# EAGLE design IO_iJoey (EAGLE 6.1)
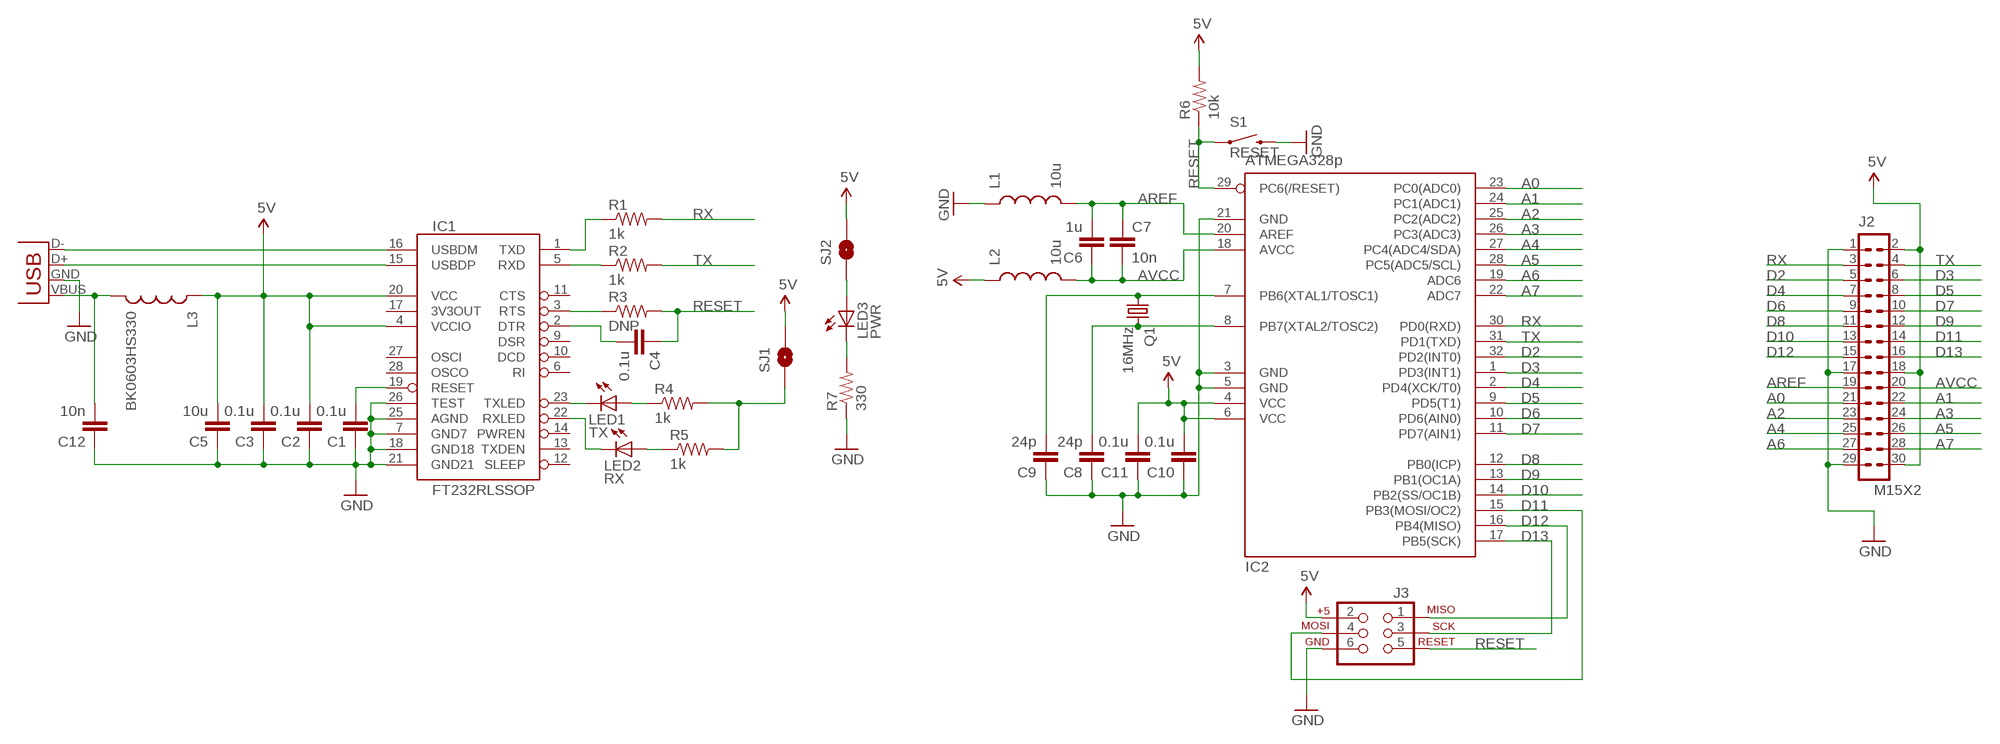
[diagram p0: schematic, sheet 1]

## Parts
C1  0.1u  CAP0603-CAP  [0603-CAP]
C2  0.1u  CAP0603-CAP  [0603-CAP]
C3  0.1u  CAP0603-CAP  [0603-CAP]
C4  0.1u  CAP0603-CAP  [0603-CAP]
C5  10u  CAP0805  [0805]
C6  1u  CAP0603-CAP  [0603-CAP]
C7  10n  CAP0603-CAP  [0603-CAP]
C8  24p  CAP0603-CAP  [0603-CAP]
C9  24p  CAP0603-CAP  [0603-CAP]
C10  0.1u  CAP0603-CAP  [0603-CAP]
C11  0.1u  CAP0603-CAP  [0603-CAP]
C12  10n  CAP0603-CAP  [0603-CAP]
IC1  FT232RLSSOP  [SSOP28DB]
IC2  ATMEGA328p  MEGA8-AI  [TQFP32-08]
J1  USB-A-H  [USB-A-H]
J2  M15X2  [2X15]
J3  AVR_SPI_PRG_6PTH  [2X3]
L1  10u  INDUCTOR0603  [0603]
L2  10u  INDUCTOR0603  [0603]
L3  BK0603HS330  INDUCTOR0603  [0603]
LED1  TX  LED0603  [LED-0603]
LED2  RX  LED0603  [LED-0603]
LED3  PWR  LED0603  [LED-0603]
Q1  16MHz  CRYSTAL-GP  [HC49_GP]
R1  1k  RESISTOR0603-RES  [0603-RES]
R2  1k  RESISTOR0603-RES  [0603-RES]
R3  DNP  RESISTOR0603-RES  [0603-RES]
R4  1k  RESISTOR0603-RES  [0603-RES]
R5  1k  RESISTOR0603-RES  [0603-RES]
R6  10k  RESISTOR0603-RES  [0603-RES]
R7  330  RESISTOR0603-RES  [0603-RES]
S1  RESET  SWITCH-MOMENTARY-2-SMD-1101NE  [TACTILE-SWITCH-1101NE]
SJ1  SOLDERJUMPERNC  [SJ_2S]
SJ2  SOLDERJUMPERNC  [SJ_2S]

## Nets
5V: C2.2 C3.2 C5.2 C10.2 C11.2 IC1.4(VCCIO) IC1.20(VCC) IC2.4(VCC) IC2.6(VCC) J2.2 J2.18 J2.30 J3.2 L2.1 L3.1 R6.2 SJ1.2 SJ2.2
A0: IC2.23(PC0(ADC0)) J2.21
A1: IC2.24(PC1(ADC1)) J2.22
A2: IC2.25(PC2(ADC2)) J2.23
A3: IC2.26(PC3(ADC3)) J2.24
A4: IC2.27(PC4(ADC4/SDA)) J2.25
A5: IC2.28(PC5(ADC5/SCL)) J2.26
A6: IC2.19(ADC6) J2.27
A7: IC2.22(ADC7) J2.28
AREF: C6.2 C7.1 IC2.20(AREF) J2.19 L1.2
AVCC: C6.1 C7.2 IC2.18(AVCC) J2.20 L2.2
D2: IC2.32(PD2(INT0)) J2.5
D3: IC2.1(PD3(INT1)) J2.6
D4: IC2.2(PD4(XCK/T0)) J2.7
D5: IC2.9(PD5(T1)) J2.8
D6: IC2.10(PD6(AIN0)) J2.9
D7: IC2.11(PD7(AIN1)) J2.10
D8: IC2.12(PB0(ICP)) J2.11
D9: IC2.13(PB1(OC1A)) J2.12
D10: IC2.14(PB2(SS/OC1B)) J2.13
D11: IC2.15(PB3(MOSI/OC2)) J2.14 J3.4
D12: IC2.16(PB4(MISO)) J2.15 J3.1
D13: IC2.17(PB5(SCK)) J2.16 J3.3
GND: C1.1 C2.1 C3.1 C5.1 C8.1 C9.1 C10.1 C11.1 C12.1 IC1.7(GND7) IC1.18(GND18) IC1.21(GND21) IC1.25(AGND) IC1.26(TEST) IC2.3(GND) IC2.5(GND) IC2.21(GND) J1.GND(VBUS) J2.1 J2.17 J2.29 J3.6 L1.1 R7.1 S1.P$2
N$1: IC1.15(USBDP) J1.D+(D-)
N$2: IC1.16(USBDM) J1.D-(D+)
N$3: C4.2 IC1.2(DTR)
N$4: C1.2 IC1.19(RESET)
N$5: C12.2 J1.VBUS(GND) L3.2
N$6: IC1.3(RTS) R3.1
N$7: IC1.5(RXD) R2.1
N$8: IC1.1(TXD) R1.1
N$9: LED3.C R7.2
N$10: IC1.23(TXLED) LED1.C
N$11: IC1.22(RXLED) LED2.C
N$12: LED2.A R5.1
N$13: LED1.A R4.1
N$14: R4.2 R5.2 SJ1.1
N$15: LED3.A SJ2.1
N$17: C9.2 IC2.7(PB6(XTAL1/TOSC1)) Q1.1
N$18: C8.2 IC2.8(PB7(XTAL2/TOSC2)) Q1.2
RESET: C4.1 IC2.29(PC6(/RESET)) J3.5 R3.2 R6.1 S1.P$1
RX: IC2.30(PD0(RXD)) J2.3 R1.2
TX: IC2.31(PD1(TXD)) J2.4 R2.2
Unconnected: IC1.6(RI) IC1.9(DSR) IC1.10(DCD) IC1.11(CTS) IC1.12(SLEEP) IC1.13(TXDEN) IC1.14(PWREN) IC1.17(3V3OUT) IC1.27(OSCI) IC1.28(OSCO)

## Library data of the parts
C1-C12 = BUG:CAP: Capacitor Standard 0603 ceramic capacitor, and 0.1" leaded capacitor.
IC1 = SparkFun-DigitalIC:FT232RL: USB UART FT232RL 4th Generation USB UART (USB <-> Serial) Controller. Spark Fun Electronics SKU : COM-00650
IC2 = atmel:MEGA8: MICROCONTROLLER 8 Kbytes FLASH, 1 kbytes SRAM, 512 bytes EEPROM, USART, 6-channel 10 bit ADC, 2-channel 8 bit ADC Pin compatible with Atmega48, ATMega88, ATMega168 Source: avr.lbr; MPN: ATMEGA8-16AU; OC_FARNELL: 9171371; OC_NEWARK: 73M8863
J1 = SparkFun-Connectors:USB: USB Connectors USB-B-PTH is fully proven SKU : PRT-00139 USB-miniB is fully proven SKU : PRT-00587 USB-A-PCB is untested. USB-A-H is throughly reviewed, but untested. Spark Fun Electronics SKU : PRT-00437 USB-B-SMT is throughly reviewed, but untested. Needs silkscreen touching up. USB-A-S has not been used/tested USB-MB-H has not been used/tested
J2 = BUG:M15X2: header dual row 30 position M15X2
J3 = SparkFun-Connectors:AVR_SPI_PRG_6: AVR ISP 6 Pin This is the reduced ISP connector for AVR programming. Common on Arduino. This footprint will take up less PCB space and can be used with a 10-pin to 6-pin adapter such as SKU: BOB-08508
L1-L3 = BUG:INDUCTOR: Inductors Basic Inductor/Choke - 0603 and 1206. Footprints are not proven and vary greatly between part numbers.
LED1-LED3 = BUG:LED: LEDs Standard schematic elements and footprints for 5mm, 3mm, 1206, and 0603 sized LEDs. 5mm - Spark Fun Electronics SKU : COM-00529 (and others)
Q1 = BUG:CRYSTAL: CRYSTAL
R1-R7 = BUG:RESISTOR: Resistor Basic schematic elements and footprints for 0603, 1206, and PTH resistors.
S1 = SparkFun-Electromechanical:SWITCH-MOMENTARY-2: Various NO switches- pushbuttons, reed, etc
SJ1 SJ2 = SparkFun-Passives:SOLDERJUMPER: Solder Jumper Standard SMD solder jumper. Used to automate production. Two varients : Normally Open and Normally Closed are the same, but have different paste layers. NC will have a large amount of paste and should jumper during reflow.

## Board
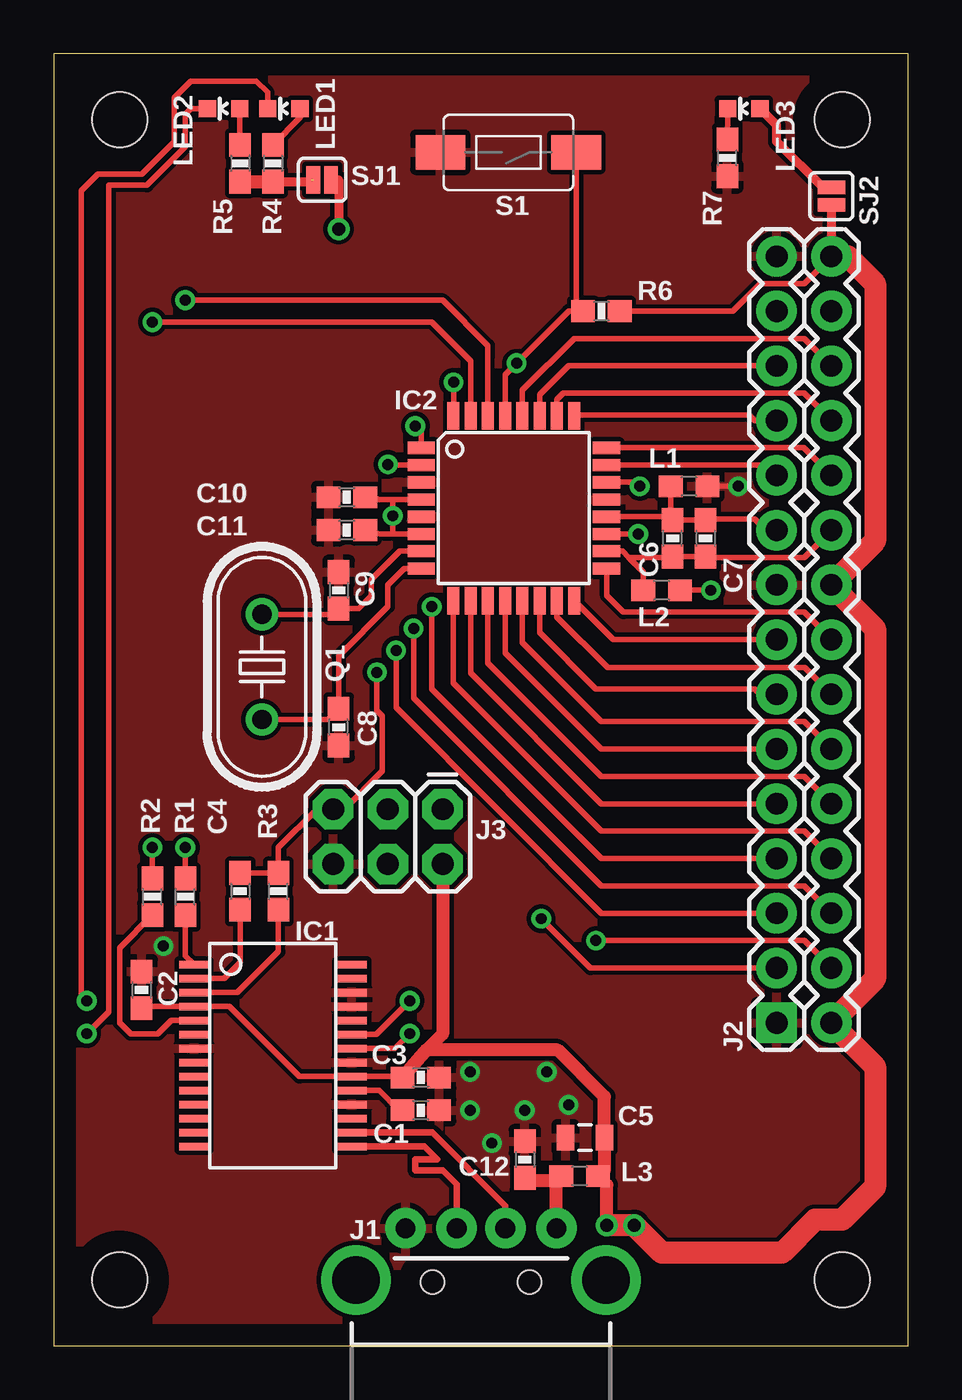
[diagram p1: board, top side]
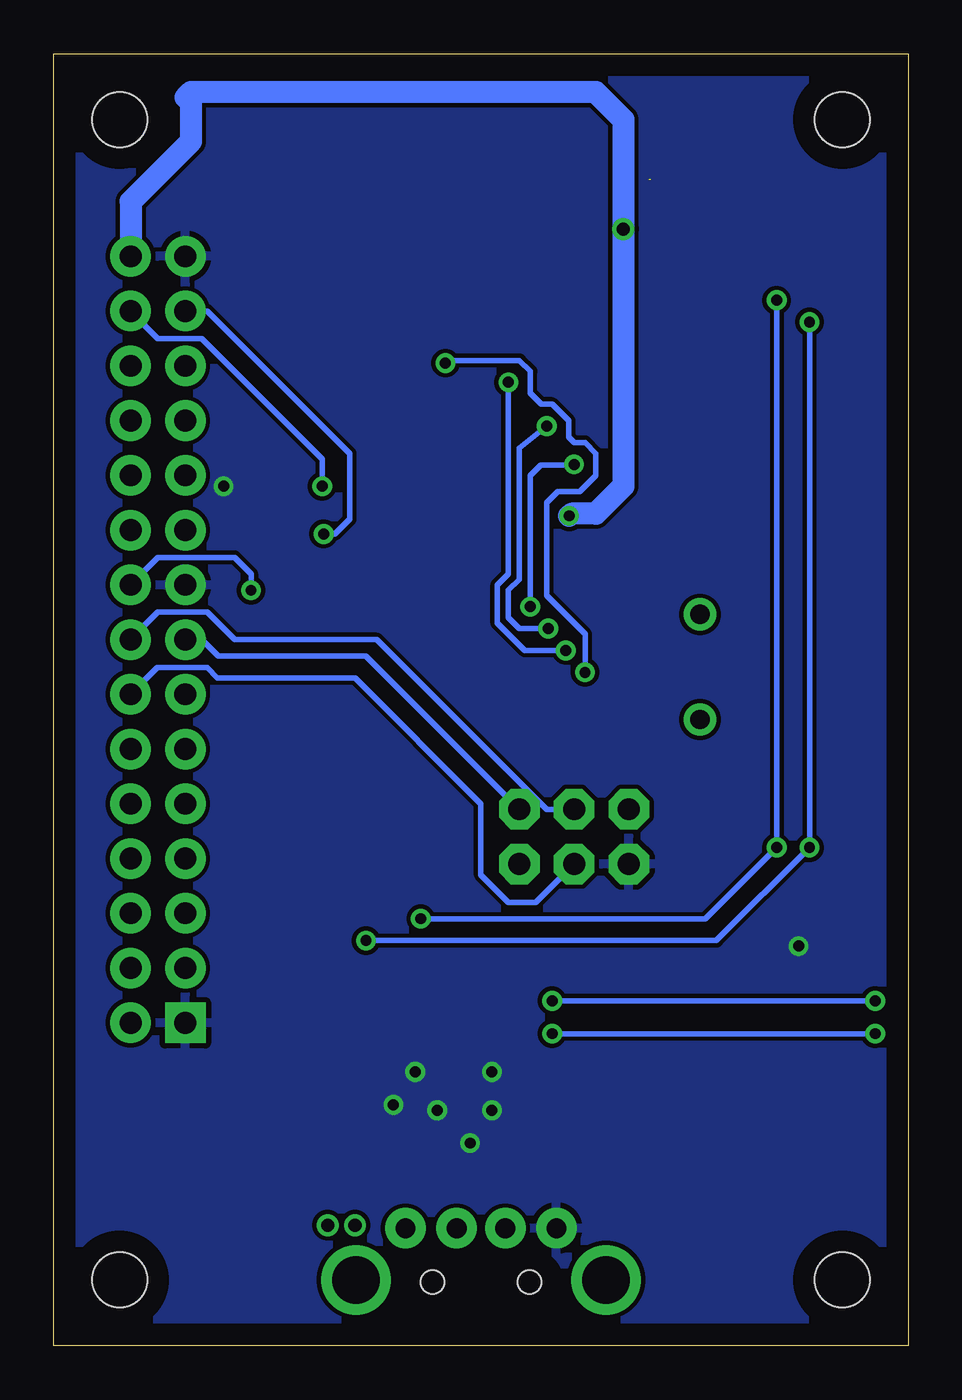
[diagram p2: board, bottom side, seen from below]

Size 39.62 x 59.94 mm. Coordinates in mm from the lower left corner, seen from the top.
Outline: 0,0 39.62,0 39.62,59.94 0,59.94 0,0
Copper layers (1*16): Top 0.035mm / dielectric 1.5mm / Bottom 0.035mm
Design rules: minimum track width 10mil, minimum drill 24mil, track to track 8mil, track to pad 8mil, pad to pad 8mil, via to via 8mil, smd to smd 8mil, copper to edge 40mil, drill to drill 8mil, minimum pad ring 10mil, minimum via ring 8mil, stop-mask expansion 4mil, vias tented up to drill 0mil, thermal gap 10mil
Holes 2.54 mm at 36.58,3.05 3.05,3.05 3.05,56.9 36.58,56.9

### Footprints (pad centres in the part's own frame; a part is rotated, then mirrored left to right if it is on the bottom)
0603-CAP = smd 1.1 x 1: 1 -0.85,0; 2 0.85,0
0805 = smd 0.8 x 1.2: 1 -0.9,0; 2 0.9,0
SSOP28DB = smd 0.348 x 1.397: 1 -4.225,-3.656; 2 -3.575,-3.656; 3 -2.925,-3.656; 4 -2.275,-3.656; 5 -1.625,-3.656; 6 -0.975,-3.656; 7 -0.325,-3.656; 8 0.325,-3.656; 9 0.975,-3.656; 10 1.625,-3.656; 11 2.275,-3.656; 12 2.925,-3.656; 13 3.575,-3.656; 14 4.225,-3.656; 15 4.225,3.656; 16 3.575,3.656; 17 2.925,3.656; 18 2.275,3.656; 19 1.625,3.656; 20 0.975,3.656; 21 0.325,3.656; 22 -0.325,3.656; 23 -0.975,3.656; 24 -1.625,3.656; 25 -2.275,3.656; 26 -2.925,3.656; 27 -3.575,3.656; 28 -4.225,3.656
TQFP32-08 = smd 1.27 x 0.559: 1 -4.293,2.8; 2 -4.293,2; 3 -4.293,1.2; 4 -4.293,0.4; 5 -4.293,-0.4; 6 -4.293,-1.2; 7 -4.293,-2; 8 -4.293,-2.8; 17 4.293,-2.8; 18 4.293,-2; 19 4.293,-1.2; 20 4.293,-0.4; 21 4.293,0.4; 22 4.293,1.2; 23 4.293,2; 24 4.293,2.8 | smd 0.559 x 1.27: 9 -2.8,-4.293; 10 -2,-4.293; 11 -1.2,-4.293; 12 -0.4,-4.293; 13 0.4,-4.293; 14 1.2,-4.293; 15 2,-4.293; 16 2.8,-4.293; 25 2.8,4.293; 26 2,4.293; 27 1.2,4.293; 28 0.4,4.293; 29 -0.4,4.293; 30 -1.2,4.293; 31 -2,4.293; 32 -2.8,4.293
USB-A-H = drill 0.914 pad 1.88: D+ 2.4,1.127; D- 2.4,-1.127; GND 2.4,3.5; VBUS 2.4,-3.5 | drill 2.2: GND2 0,-5.8; GND3 0,5.8 | hole 1.1: -0.1,2.25; -0.1,-2.25
2X15 = drill 1.016 pad 1.88 square: 1 -17.78,1.27 | drill 1.016 pad 1.88: 2 -17.78,-1.27; 3 -15.24,1.27; 4 -15.24,-1.27; 5 -12.7,1.27; 6 -12.7,-1.27; 7 -10.16,1.27; 8 -10.16,-1.27; 9 -7.62,1.27; 10 -7.62,-1.27; 11 -5.08,1.27; 12 -5.08,-1.27; 13 -2.54,1.27; 14 -2.54,-1.27; 15 0,1.27; 16 0,-1.27; 17 2.54,1.27; 18 2.54,-1.27; 19 5.08,1.27; 20 5.08,-1.27; 21 7.62,1.27; 22 7.62,-1.27; 23 10.16,1.27; 24 10.16,-1.27; 25 12.7,1.27; 26 12.7,-1.27; 27 15.24,1.27; 28 15.24,-1.27; 29 17.78,1.27; 30 17.78,-1.27
2X3 = drill 1.016 pad 1.88 octagon: 1 0,0; 2 0,2.54; 3 2.54,0; 4 2.54,2.54; 5 5.08,0; 6 5.08,2.54
0603 = smd 1.1 x 1: 1 -0.85,0; 2 0.85,0
LED-0603 = smd 0.8 x 0.8: A 0,-0.75; C 0,0.75
HC49_GP = drill 0.9 pad 1.499: 1 -2.44,0; 2 2.44,0
0603-RES = smd 1.1 x 1: 1 -0.85,0; 2 0.85,0
TACTILE-SWITCH-1101NE = smd 2.3 x 1.6: P$1 -3.15,0; P$2 3.15,0
SJ_2S = smd 0.635 x 1.27: 1 -0.412,0; 2 0.412,0

### Placement (x,y rotation side)
C1  17.02,10.92 180 top
C2  4.06,16.51 270 top
C3  17.02,12.45 180 top
C4  8.64,21.08 270 top
C5  24.64,9.65 0 top
C6  28.7,37.47 90 top
C7  30.23,37.47 270 top
C8  13.21,28.7 90 top
C9  13.21,35.05 270 top
C10  13.59,39.37 0 top
C11  13.59,37.85 0 top
C12  21.84,8.64 270 top
IC1  10.16,13.46 270 top
IC2  21.34,38.86 0 top
J1  19.81,3.05 90 top
J2  34.8,32.77 90 top
J3  18.03,24.89 180 top
L1  29.46,39.88 180 top
L2  28.19,35.05 180 top
L3  24.38,7.87 180 top
LED1  10.67,57.4 90 top
LED2  7.87,57.4 90 top
LED3  32,57.4 90 top
Q1  9.65,31.5 270 top
R1  6.1,20.83 90 top
R2  4.57,20.83 90 top
R3  10.41,21.08 90 top
R4  10.16,54.86 270 top
R5  8.64,54.86 270 top
R6  25.4,48.01 0 top
R7  31.24,55.12 90 top
S1  21.08,55.37 180 top
SJ1  12.45,54.1 0 top
SJ2  36.07,53.34 270 top

### Tracks (layer width: path | path; a pad name or v marks a point on that pad's centre or on a via)
5V  (via drill 0.51, 0.61)
  Top 0.254: L2.1 v30.48,35.05 | C11.2 15.14,37.66 15.75,37.66 | IC2.4 15.75,39.26 | 15.75,39.26 15.23,39.26 | 15.18,39.26 C10.2 | 15.75,37.66 IC2.6 16.59,37.66 | 15.18,39.26 14.97,39.26 14.61,39.62 | 16.41,39.27 15.24,39.27 | 15.24,39.27 15.19,39.27 | 15.18,39.26 15.23,39.26 | 15.23,39.26 15.24,39.27 | 15.75,37.66 15.72,37.69 v15.72,38.51 15.72,39.24 15.75,39.26 | C3.2 16.13,12.49 IC1.20 11.39,12.49 8.13,15.75 6.51,15.75 IC1.4 4.05,15.74 3.81,15.49 3.98,15.49 C2.2 | R6.2 31.5,48.01 32.77,49.28 34.8,49.28 J2.30
  Top 0.406: SJ1.2 13.21,54.1 v13.21,51.82 | SJ2.2 J2.30
  Top 0.61: v25.65,5.59 25.65,7.45 L3.1 25.54,8.18 C5.2 25.54,11.55 23.37,13.72 17.27,13.72 17.16,13.59 | 17.16,13.59 16.26,12.53 C3.2 | 13.12,51.98 v13.21,51.82 | J3.2 18.03,14.46 17.16,13.59
  Top 1.016: J2.30 36.83,50.55 38.1,49.28 38.1,37.34 J2.18 38.1,33.27 38.1,17.02 J2.2 38.1,12.95 38.1,7.37 36.58,5.84 35.31,5.84 33.78,4.32 28.19,4.32 v26.92,5.59 v25.65,5.59
  Bottom 0.254: 36.07,35.05 J2.18 34.8,36.58 31.24,36.58 30.48,35.81 v30.48,35.05
  Bottom 1.016: 33.27,58.17 14.48,58.17 13.21,56.9 v13.21,51.82 13.21,39.88 14.48,38.61 15.62,38.61 v15.72,38.51 | 33.27,58.17 33.53,57.91 | 33.27,58.17 33.27,55.88 36.07,53.09 J2.30
A0
  Top 0.254: IC2.23 33.05,40.86 J2.21
A1
  Top 0.254: J2.22 34.79,41.66 IC2.24
A2
  Top 0.254: J2.23 32.51,42.93 32.26,43.18 24.16,43.18 IC2.25
A3
  Top 0.254: J2.24 34.8,44.2 23.62,44.2 23.34,43.91 IC2.26
A4
  Top 0.254: IC2.27 22.54,44.13 23.88,45.47 J2.25
A5
  Top 0.254: IC2.28 21.74,44.34 24.13,46.74 34.8,46.74 J2.26
A6  (via drill 0.51)
  Top 0.254: IC2.19 v27.11,37.66 27.18,37.59
  Bottom 0.254: J2.27 32.51,48.01 25.91,41.4 25.91,38.35 26.6,37.66 v27.11,37.66
A7  (via drill 0.51)
  Top 0.254: IC2.22 26.99,40.06 v27.18,39.88
  Bottom 0.254: J2.28 34.8,46.74 32.77,46.74 27.18,41.15 v27.18,39.88
AREF
  Top 0.254: IC2.20 28.3,38.46 C6.2 | C6.2 C7.1 29.97,38.35 32.51,38.35 33.02,37.85 J2.19 | L1.2 28.61,38.48 C6.2
AVCC
  Top 0.254: J2.20 34.8,36.58 30.01,36.58 C7.2 C6.1 28.41,36.58 26.67,36.58 | IC2.18 26.38,36.86 26.67,36.58 | L2.2 27.34,35.9 26.67,36.58
D2  (via drill 0.51)
  Top 0.254: J2.5 25.4,20.07 15.88,29.62 v15.88,32.26 | v18.54,44.7 18.54,43.16 IC2.32
  Bottom 0.254: v15.88,32.26 17.78,32.26 19.05,33.53 19.05,35.31 18.54,35.81 v18.54,44.7
D3  (via drill 0.51)
  Top 0.254: J2.6 34.8,21.34 25.4,21.34 16.69,30.05 v16.69,33.27 | IC2.1 17.04,42.65 v16.76,42.67
  Bottom 0.254: v16.69,33.27 18.03,33.27 18.54,33.78 18.54,35.05 18.03,35.56 18.03,41.66 v16.76,42.67
D4  (via drill 0.51)
  Top 0.254: J2.7 25.4,22.61 17.53,30.48 v17.53,34.29 | IC2.2 15.53,40.86 v15.49,40.89
  Bottom 0.254: v17.53,34.29 17.53,40.38 IC2.2 15.53,40.86 v15.49,40.89
D5
  Top 0.254: J2.8 34.8,23.88 25.4,23.88 18.54,30.74 IC2.9
D6
  Top 0.254: J2.9 25.4,25.15 19.34,31.21 IC2.10
D7
  Top 0.254: J2.10 34.8,26.42 25.4,26.42 20.14,31.68 IC2.11
D8
  Top 0.254: J2.11 25.4,27.69 20.94,32.15 IC2.12
D9
  Top 0.254: J2.12 34.8,28.96 25.4,28.96 21.74,32.62 IC2.13
D10
  Top 0.254: J2.13 32.77,30.23 32.51,30.48 25.15,30.48 22.54,33.09 IC2.14
D11
  Top 0.254: J2.14 34.83,31.46 25.69,31.46 23.34,33.81 IC2.15
  Bottom 0.254: J3.4 17.27,20.57 18.54,20.57 19.81,21.84 19.81,25.15 25.65,30.99 32.04,30.99 32.51,31.46 34.83,31.46 J2.14
D12
  Top 0.254: J2.15 25.94,32.77 IC2.16
  Bottom 0.254: J3.1 25.15,32 32,32 32.77,32.77 J2.15
D13
  Top 0.254: J2.16 34.8,34.04 26.42,34.04 25.65,34.8 25.65,36.04 IC2.17
  Bottom 0.254: J3.3 16.76,24.89 24.64,32.77 31.24,32.77 32.51,34.04 34.8,34.04 J2.16
GND  (via drill 0.51)
  Top 0.254: L1.1 v31.75,39.88
  other vias: 19.3,12.7 22.86,12.7 23.88,11.18 21.84,10.92 20.32,9.4 19.3,10.92 5.08,18.54
  pour Bottom (rank 4): 0.51,59.44 39.12,59.44 39.12,0.51 0.51,0.51
  pour Top (rank 4): 0.51,59.44 39.12,59.44 39.12,0.51 0.51,0.51
N$1
  Top 0.305: J1.D+ 18.68,7.48 18.03,8.13 16.76,8.13 16.76,8.64 17.78,8.64 17.18,9.24 IC1.15
N$2
  Top 0.305: 20.94,5.73 J1.D- 20.94,6.49 17.55,9.89 IC1.16
N$3
  Top 0.254: IC1.2 7.89,17.04 8.64,17.78 C4.2
N$4
  Top 0.254: IC1.19 15.09,11.84 16,10.92 C1.2 16.26,10.92
N$5
  Top 0.61: J1.VBUS 23.31,7.65 | 23.31,7.65 L3.2 | 23.31,7.65 21.98,7.65 C12.2
N$6
  Top 0.254: IC1.3 8.51,16.39 10.41,18.29 R3.1
N$7
  Top 0.254: IC1.5 5.43,15.09 4.83,14.48 3.56,14.48 3.05,14.99 3.05,18.45 R2.1
N$8
  Top 0.254: R1.1 6.1,18.09 IC1.1
N$9
  Top 0.254: LED3.C 31.23,55.73 R7.2
N$10  (via drill 0.51)
  Top 0.254: LED1.C 9.92,58.15 9.4,58.67 6.35,58.67 5.59,57.91 5.59,55.88 4.06,54.36 2.03,54.36 1.27,53.59 1.27,16.26 v1.52,16 | IC1.23 14.95,14.44 v16.51,16
  Bottom 0.254: v1.52,16 v16.51,16
N$11  (via drill 0.51)
  Top 0.254: LED2.C 6.35,57.4 6.1,57.15 6.1,55.63 4.32,53.85 2.54,53.85 2.54,15.49 v1.52,14.48 | IC1.22 15.82,13.79 v16.51,14.48
  Bottom 0.254: v1.52,14.48 v16.51,14.48
N$12
  Top 0.254: LED2.A 8.62,55.73 R5.1
N$13
  Top 0.254: LED1.A 11.42,57 R4.1
N$14  (1 unrouted)
  Top 0.406: R4.2 11.94,54.01 11.94,54.1
  Top 0.61: R5.2 R4.2
N$15
  Top 0.406: SJ2.1 35.66,53.75 33.53,55.88 33.53,56.64 32.77,57.4 LED3.A
N$17
  Top 0.254: IC2.7 16.03,36.86 14.73,35.56 14.73,34.8 14.14,34.2 C9.2 12.94,33.94 Q1.1
N$18
  Top 0.254: IC2.8 16.25,36.06 15.49,35.31 15.49,34.29 13.21,32 C8.2 12.71,29.06 Q1.2
RESET  (via drill 0.51)
  Top 0.254: IC2.29 20.94,45.07 v21.46,45.59 23.88,48.01 R6.1 24.23,48.32 S1.P$1 | v14.99,31.24 14.99,29.46 15.24,29.21 15.24,26.67 13.46,24.89 J3.5 12.19,24.89 10.41,23.11 R3.2 C4.1
  Bottom 0.254: v14.99,31.24 14.99,33.02 16.76,34.8 16.76,39.12 16.26,39.62 15.24,39.62 14.48,40.39 14.48,41.4 14.99,41.91 15.49,41.91 15.75,42.16 15.75,42.93 16.51,43.69 17.02,43.69 17.53,44.2 17.53,45.21 18.03,45.72 21.34,45.72 v21.46,45.59
RX  (via drill 0.51)
  Top 0.254: 20.14,45.9 IC2.30 20.14,46.41 18.03,48.51 v6.1,48.51 | R1.2 v6.1,23.11 | J2.3 24.89,17.53 v22.61,19.81
  Bottom 0.254: v22.61,19.81 9.4,19.81 v6.1,23.11 v6.1,48.51
TX  (via drill 0.51)
  Top 0.254: IC2.31 19.34,45.69 17.53,47.5 v4.57,47.5 | R2.2 v4.57,23.11 | J2.4 34.8,18.8 v25.15,18.8
  Bottom 0.254: v25.15,18.8 8.89,18.8 v4.57,23.11 v4.57,47.5